# Altium schematic sheet Sheet1.SchDoc
size A0; SheetNumber: 1; SheetTotal: 1
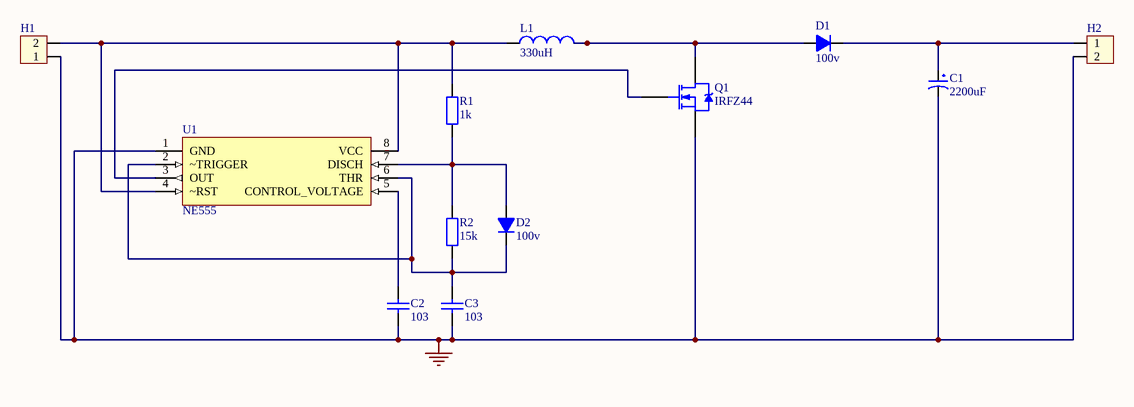
[diagram p0: Sheet1.SchDoc]

## Parts
C1  2200uF  [tu hoa 13mm]
C2  103  [tu gom]
C3  103  [tu gom]
D1  100v  [DIODE 1A]
D2  100v  [DIODE 0.5A]
H1  Header 2P 2.54 Duc Cong  [Header 2P DC 2.54]  (value not drawn)
H2  Header 2P 2.54 Duc Cong  [Header 2P DC 2.54]  (value not drawn)
L1  330uH  [IND_30.1MM_TH]
Q1  IRFZ44  [TO220]
R1  1k  [tro vach 1w]
R2  15k  [tro vach 1w]
U1  NE555  [PDIP-8_100_393_66X66_TH]

## Nets
GND: C1.2 C2.2 C3.2 H1.1 H2.2 Q1.3(S) U1.1(GND)
NetC1_1: C1.1 D1.2(K) H2.1
NetC2_1: C2.1 U1.5(CONTROL_VOLTAGE)
NetC3_1: C3.1 D2.2(K) R2.2 U1.2(~TRIGGER) U1.6(THR)
NetD1_1: D1.1(A) L1.2 Q1.2(D)
NetD2_1: D2.1(A) R1.1 R2.1 U1.7(DISCH)
NetH1_2: H1.2 L1.1 R1.2 U1.4(~RST) U1.8(VCC)
NetQ1_1: Q1.1(G) U1.3(OUT)

## Library data of the parts
C1 = Tu Hoa 2200uF 25V 13x20: Cắm; So_Chan: 2; Don_Vi: Con; Ten_Linh_Kien: Tụ Hóa 2200uF 25V 13x20MM; Ma_Hang: MH002203; Chung_Loai: Cắm; Kieu_Chan: *
C2 C3 = Tu gom 103 50V: Cắm; So_Chan: 2; Ten_Linh_Kien: Tụ gốm 103 10nF 50V; Don_Vi: Con; Ma_Hang: MH000936; Chung_Loai: Cắm; Kieu_Chan: *
D1 = Diode 1N4007: Cắm; Ten_Linh_Kien: Diode 1N4007 1A (DIP); Don_Vi: Con; Ma_Hang: MH001063; Ghi Chu: *; Kieu_Chan: *; Chung_Loai: Cắm
D2 = Diode 1N4148: Cắm; Ten_Linh_Kien: Diode 1N4148 DO35 450mA 100V ( 1N4148 DIP); Don_Vi: Con; Ma_Hang: MH001065; Ghi Chu: *; Kieu_Chan: *; Chung_Loai: Cắm
H1 H2 = Header 2P 2.54 Duc Cong: Cắm; Ten_Linh_Kien: Header 2P XH2.54-2P Đực Cong; Don_Vi: Con; Ma_Hang: MH002852; Chung_Loai: Cắm
L1 = IND_330uH-10A-TH: 330uH-10A-CHINESE INDUCTOR; Manufacturer Part Number: NA; Case/Package: TH; Manufacturer: NA; Supplier-1: SP ROAD; Supplier Part Number-1: NA; Alternate Part Number-1: NA
Q1 = IRFZ44 DIP: N-Channel Power MOSFET
R1 = Tro Vach 1W 5% 1k: Cắm; Don_Vi: Con; So_Chan: 2; Ten_Linh_Kien: Trở 5% 1w 1k; Ma_Hang: MH006397; Chung_Loai: Cắm; Kieu_Chan: *
R2 = Tro Vach 1W 5% 15k: Cắm; Don_Vi: Con; So_Chan: 2; Ten_Linh_Kien: Trở 5% 1w 15k; Ma_Hang: MH006396; Chung_Loai: Cắm; Kieu_Chan: *
U1 = IC_LMC555CN/NOPB: 555 Type, Timer/Oscillator (Single) IC 3MHz 8-PDIP; Manufacturer: Texas Instruments; Alternate Part Number-1: NE555N; Manufacturer Part Number: LMC555CN/NOPB; Case/Package: 8-PDIP; Supplier-1: Digikey; Supplier Part Number-1: LMC555CN/NOPB-ND